# Altium schematic sheet Nrf2460_2.SchDoc: nRF2789_Dual_Wireless_Mic_RX
size A4; DrawnBy: ANOL; Revision: 1.0
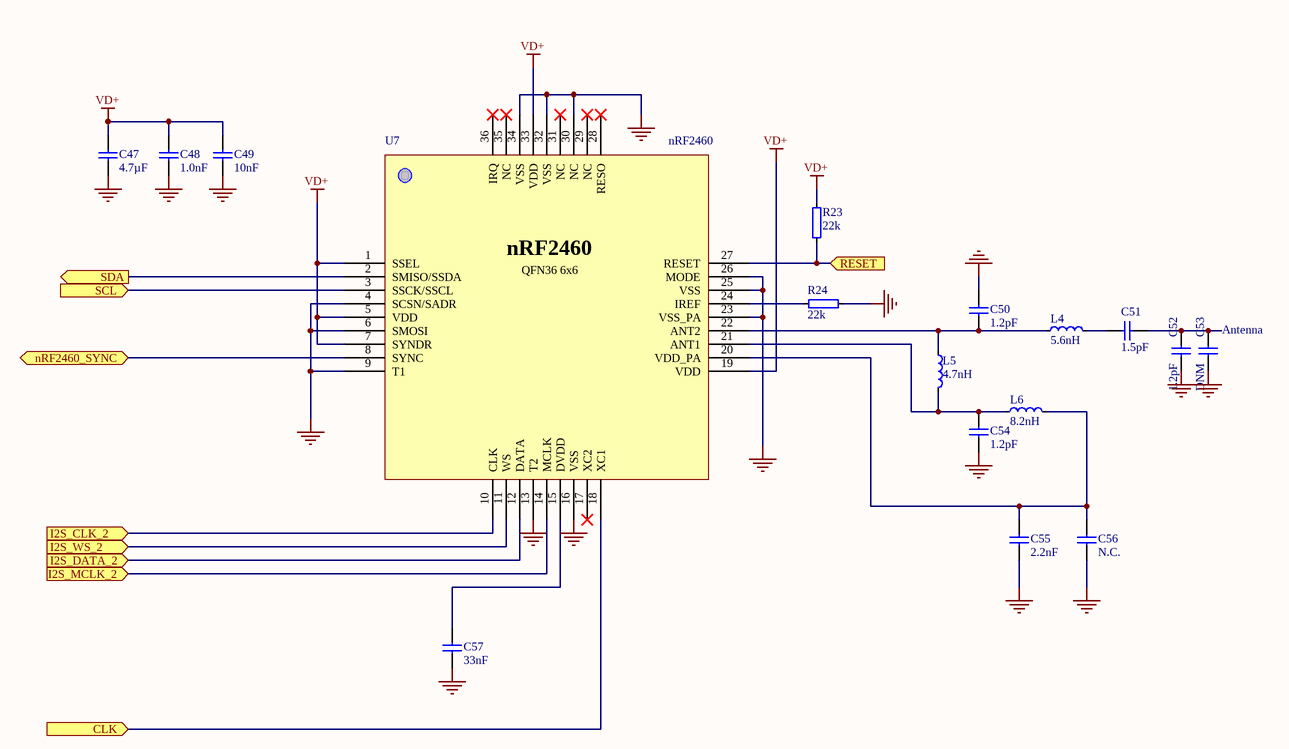
[diagram p0: Nrf2460_2.SchDoc]

## Parts
C47  4.7µF  [0805]
C48  1.0nF  [0402s]
C49  10nF  [0402s]
C50  1.2pF  [0402s]
C51  1.5pF  [0402s]
C52  1.2pF  [0402s]
C53  DNM  [0402s]
C54  1.2pF  [0402s]
C55  2.2nF  [0402s]
C56  N.C.  [0402s]  (no BOM)
C57  33nF  [0402s]
L4  5.6nH  [0402s]
L5  4.7nH  [0402s]
L6  8.2nH  [0402s]
R23  22k  [0402s]
R24  22k  [0402s]
U7  nRF2460  [Nordic_QFN36]

## Ports
CLK (in), I2S_CLK_2 (in), I2S_DATA_2 (in), I2S_MCLK_2 (in), I2S_WS_2 (in), nRF2460_SYNC (bidir), RESET (in), SCL (in), SDA (out)

## Nets
GND: C47.2 C48.2 C49.2 C50.2 C52.1 C53.1 C54.1 C55.1 C56.1 C57.1 R24.1 U7.4(SCSN/SADR) U7.6(SMOSI) U7.9(T1) U7.13(T2) U7.16(VSS) U7.23(VSS_PA) U7.25(VSS) U7.26(MODE) U7.30(NC) U7.32(VSS) U7.34(VSS)
VD+: C47.1 C48.1 C49.1 R23.2 U7.1(SSEL) U7.5(VDD) U7.7(SYNDR) U7.19(VDD) U7.33(VDD)
CLK: U7.18(XC1) ; port CLK
I2S_CLK_2: U7.10(CLK) ; port I2S_CLK_2
I2S_DATA_2: U7.12(DATA) ; port I2S_DATA_2
I2S_MCLK_2: U7.14(MCLK) ; port I2S_MCLK_2
I2S_WS_2: U7.11(WS) ; port I2S_WS_2
nRF2460_SYNC: U7.8(SYNC) ; port nRF2460_SYNC
RESET: R23.1 U7.27(RESET) ; port RESET
SCL: U7.3(SSCK/SSCL) ; port SCL
SDA: U7.2(SMISO/SSDA) ; port SDA
NetC50_1: C50.1 L4.1 L5.1 U7.22(ANT2)
NetC51_1: C51.1 C52.2 C53.2
NetC51_2: C51.2 L4.2
NetC54_2: C54.2 L5.2 L6.1 U7.21(ANT1)
NetC55_2: C55.2 C56.2 L6.2 U7.20(VDD_PA)
NetC57_2: C57.2 U7.15(DVDD)
NetR24_2: R24.2 U7.24(IREF)

Not connected (* = marked no-connect by the designer): U7 17(XC2)* 28(RESO)* 29(NC)* 31(NC)* 35(NC)* 36(IRQ)*

## Notes on the sheet
- (near C53) Antenna
- (in symbol nRF2460) QFN36 6x6

## Library data of the parts
C47 = C0805-4µ7: Chip Cap 0805; Note: Chip Cap 10%; Artikkelnr Noca: 20039266; Published: 2009-08-21; LatestRevisionDate: 2009-11-23; Publisher: Nordic Semiconductor; Value: 4.7µF; Part Number: C0805-4µ7; Manufacturer: *; Manufacturer Part Number: *; Datasheet: *; Pin Count: 2; Supplier: *; Supplier part number: *; 2nd source Supplier: *; 2nd source part number: *
C48 = C0402-1n0: Chip Cap 0402; Note: Chip Cap 10%; Artikkelnr Noca: 20039223; Published: 2009-05-08; LatestRevisionDate: 2009-11-23; Publisher: Nordic Semiconductor; Value: 1.0nF; Part Number: C0402-1n0; Manufacturer: *; Manufacturer Part Number: *; Datasheet: *; Pin Count: 2; Supplier: *; Supplier part number: *; 2nd source Supplier: *; 2nd source part number: *
C49 = C0402-10n: Chip Cap 0402; Note: Chip Cap 10%; Artikkelnr Noca: 20039166; Published: 2009-05-08; LatestRevisionDate: 2009-11-23; Publisher: Nordic Semiconductor; Value: 10nF; Part Number: C0402-10n; Manufacturer: *; Manufacturer Part Number: *; Datasheet: *; Pin Count: 2; Supplier: *; Supplier part number: *; 2nd source Supplier: *; 2nd source part number: *
C50 C52-C54 = C0402-1.2p: Chip Cap 0402; Note: Chip Cap 1%; Artikkelnr Noca: N.A.; Part Number: C0402-1.2p; Manufacturer: *; Manufacturer Part Number: *; Datasheet: *; LatestRevisionDate: 2009-05-08; Pin Count: 2; Publisher: Nordic Semiconductor; Published: 2009-05-08; Supplier: *; Supplier part number: *; 2nd source Supplier: *; 2nd source part number: *
  C50 C52 C54: Value: 1.2pF
  C53: Value: DNM
C51 = C0402-1.5p: Chip Cap 0402; Note: Chip Cap 1%; Artikkelnr Noca: 20029139; Part Number: C0402-1.5p; Manufacturer: *; Manufacturer Part Number: *; Datasheet: *; LatestRevisionDate: 2009-11-23; Pin Count: 2; Publisher: Nordic Semiconductor; Published: 2009-05-08; Value: 1.5pF; Supplier: *; Supplier part number: *; 2nd source Supplier: *; 2nd source part number: *
C55 = C0402-2n2: Chip Cap 0402; Note: Chip Cap 10%; Artikkelnr Noca: 20039221; Part Number: C0402-2n2; Manufacturer: *; Manufacturer Part Number: *; Datasheet: *; LatestRevisionDate: 2009-11-23; Pin Count: 2; Publisher: Nordic Semiconductor; Published: 2009-05-08; Value: 2.2nF; Supplier: *; Supplier part number: *; 2nd source Supplier: *; 2nd source part number: *
C56 = C0402-N.C.: Chip Cap 0402; Artikkelnr Noca: N.A.; Part Number: C0402-N.C.; Manufacturer: *; Manufacturer Part Number: *; Datasheet: *; LatestRevisionDate: 2009-05-08; Pin Count: 2; Publisher: Nordic Semiconductor; Published: 2009-05-08; Value: N.C.; Note: Chip Cap; Supplier: *; Supplier part number: *; 2nd source Supplier: *; 2nd source part number: *
C57 = C0402-33n: Chip Cap 0402; Note: Chip Cap 10%; Artikkelnr Noca: 20039222; Published: 2009-05-08; Publisher: Nordic Semiconductor; Value: 33nF; Part Number: C0402-33n; Manufacturer: *; Manufacturer Part Number: *; Datasheet: *; LatestRevisionDate: 2009-11-23; Pin Count: 2; Supplier: *; Supplier part number: *; 2nd source Supplier: *; 2nd source part number: *
L4 = L0402-5n6: Chip Ind 0402; Manufacturer: Murata; Manufacturer Part Number: LQP15MN5N6B02D; Note: LQP15MN5N6B02D 5.6nH 140mA 0402; Artikkelnr Noca: 33029161; Part Number: L0402-5n6; Datasheet: http://search.murata.co.jp/Ceramy/image/img/PDF/ENG/L0075S0084LQP15M.pdf; Footprint: 0402; LatestRevisionDate: 2009-11-23; Pin Count: 2; Publisher: Nordic Semiconductor; Published: 2009-05-08; Value: 5.6nH; Supplier: Digi-Key; Supplier part number: 490-1133-1-ND; 2nd source Supplier: *; 2nd source part number: *
L5 = L0402-4n7: Chip Ind 0402; Manufacturer: Murata; Manufacturer Part Number: LQP15MN4N7B02D; Note: LQP15MN4N7B02D 4.7nH 160mA 0402; Artikkelnr Noca: 33029164; Part Number: L0402-4n7; Datasheet: http://search.murata.co.jp/Ceramy/image/img/PDF/ENG/L0075S0084LQP15M.pdf; Footprint: 0402; LatestRevisionDate: 2009-11-23; Pin Count: 2; Publisher: Nordic Semiconductor; Published: 2009-05-08; Value: 4.7nH; Supplier: Digi-Key; Supplier part number: 490-1132-1-ND; 2nd source Supplier: *; 2nd source part number: *
L6 = L0402-8n2: Chip Ind 0402; Manufacturer: Murata; Manufacturer Part Number: LQP15MN8N2B02D; Note: LQP15MN8N2B02D 8.2nH 110mA 0402; Artikkelnr Noca: 33029139; Part Number: L0402-8n2; Datasheet: http://search.murata.co.jp/Ceramy/image/img/PDF/ENG/L0075S0084LQP15M.pdf; Footprint: 0402; LatestRevisionDate: 2009-11-23; Pin Count: 2; Publisher: Nordic Semiconductor; Published: 2009-05-08; Value: 8.2nH; Supplier: Digi-Key; Supplier part number: 490-1135-1-ND; 2nd source Supplier: *; 2nd source part number: *
R23 R24 = R0402-22k: Chip Res 0402; Note: Chip Res 1%; Artikkelnr Noca: 27049105; Published: 2009-05-08; LatestRevisionDate: 2009-11-23; Publisher: Nordic Semiconductor; Value: 22k; Part Number: R0402-22k; Manufacturer: *; Manufacturer Part Number: *; Datasheet: *; Footprint: 0402; Pin Count: 2; Supplier: *; Supplier part number: *; 2nd source Supplier: *; 2nd source part number: *
U7 = nRF2460: 2.4GHz Single Chip Wireless Audio Streamer; Manufacturer: Nordic Semiconductor; Note: nRF2460 QFN36; Artikkelnr Noca: N.A.; Part Number: nRF2460; Manufacturer Part Number: nRF2460; Datasheet: *; Footprint: QFN-36; LatestRevisionDate: 2011-03-01; Pin Count: 36; Publisher: Nordic Semiconductor; Published: 2011-03-01; Value: nRF2460; Supplier: Nordic; Supplier part number: *; 2nd source Supplier: *; 2nd source part number: *